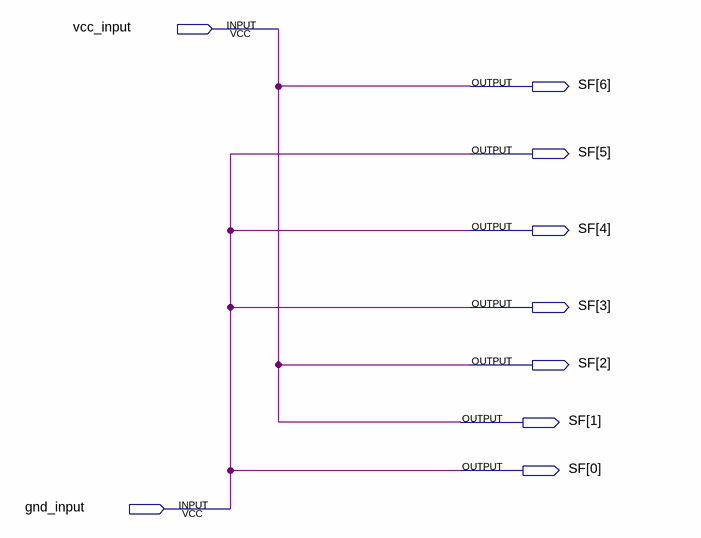
[diagram p0: schematic sheet]
// Quartus schematic control_shifta.bdf as structural Verilog: 0 symbols, 9 pins
module control_shifta (
  input  vcc_input,
  input  gnd_input,
  output [6:0] SF
);


  assign SF = {vcc_input, {3{gnd_input}}, {2{vcc_input}}, gnd_input};
endmodule
